# EAGLE design HM-Motorsteuerung (EAGLE 6.6.0)
Assembly variants: Atmega + TH, P, L, Max (RF), Atmega + TH, P, MAX (RF), Atmega + TH, L, MAX (RF), Atmega + TH, MAX (RF), Atmega + TH, P, L, (Wired)
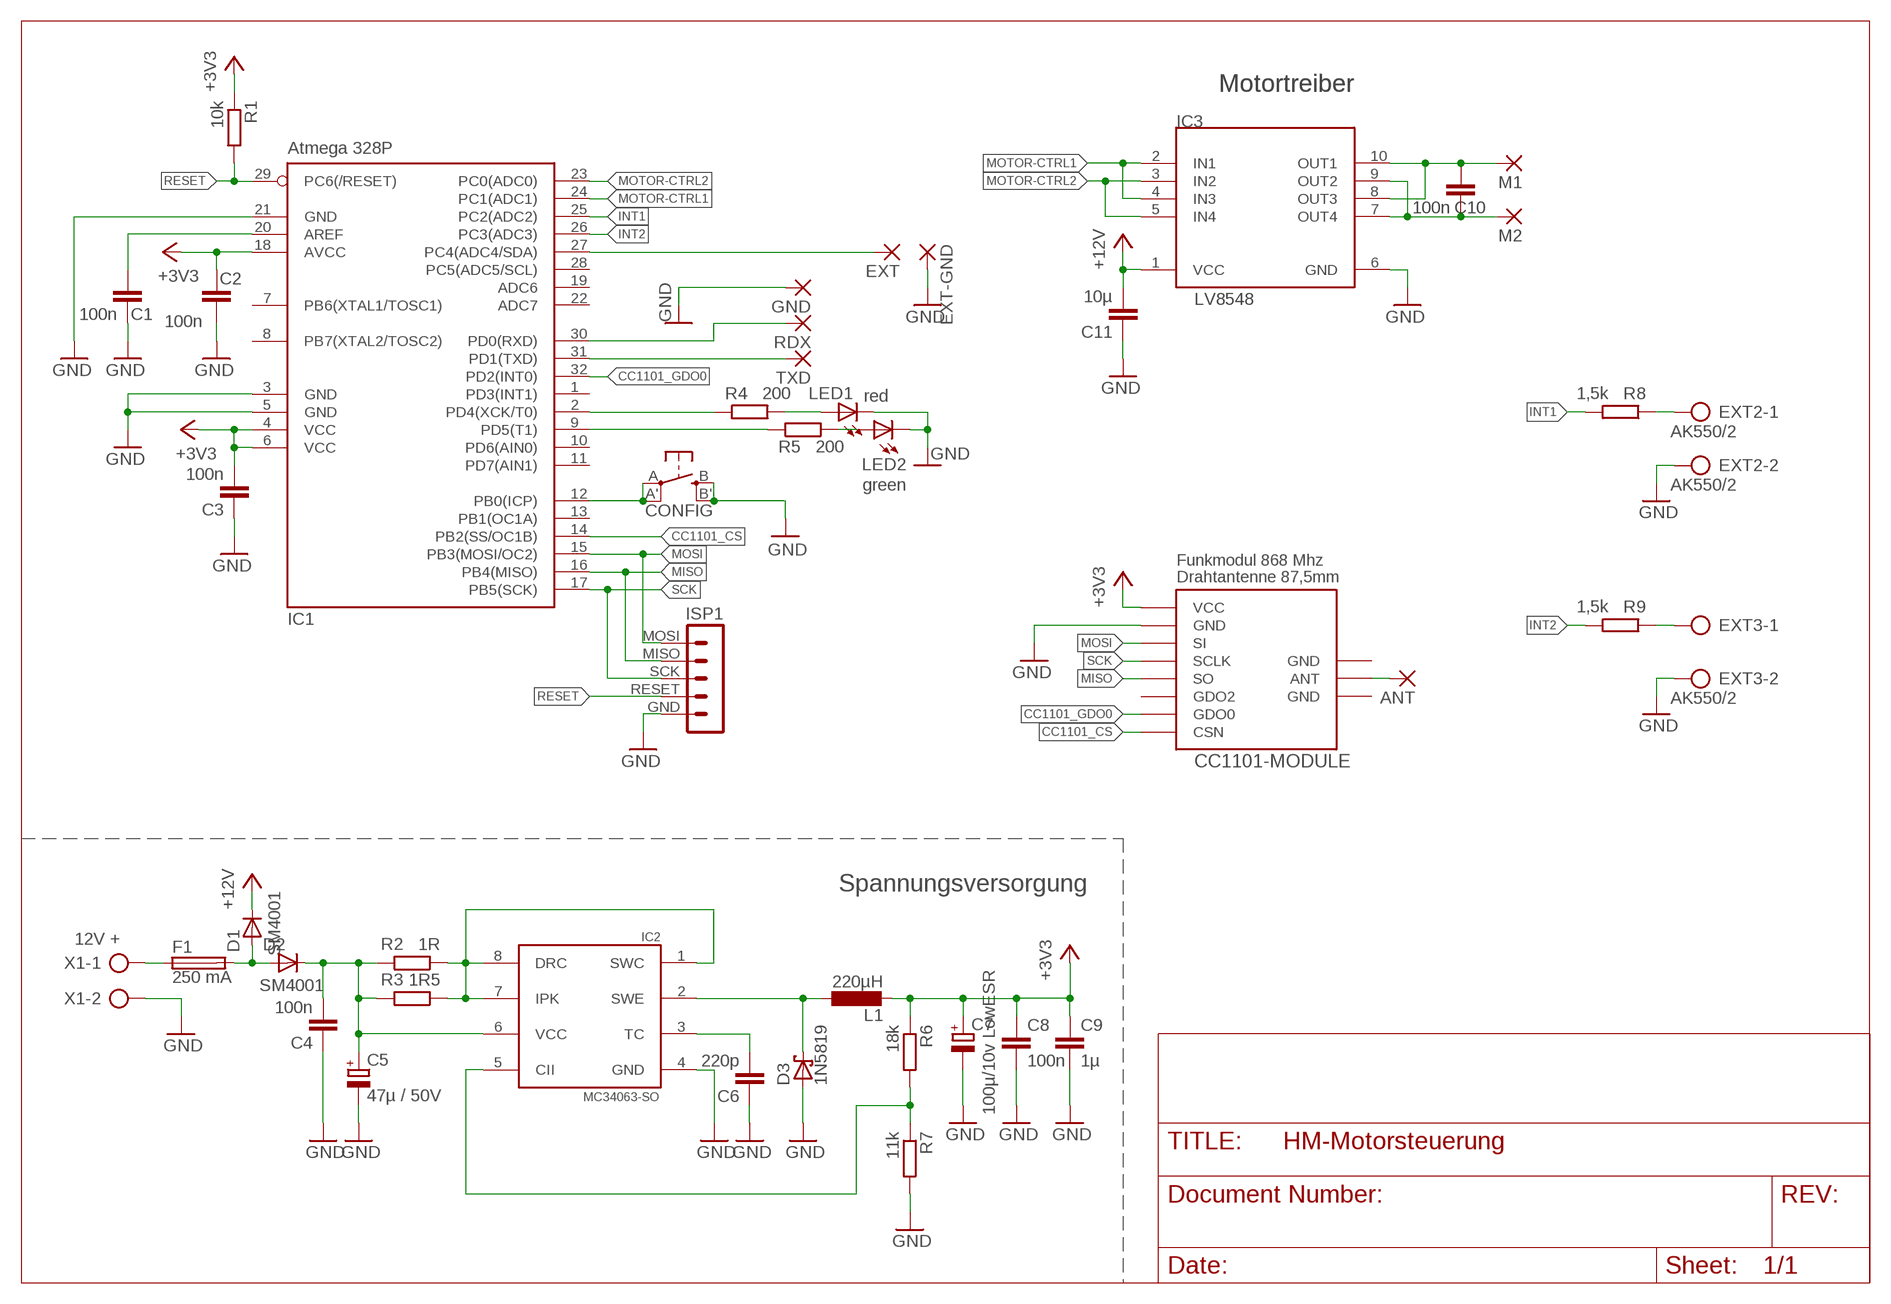
[diagram p0: schematic, sheet 1]

## Parts
ANT  1,6/0,8  [1,6/0,8]  (not fitted in variant Atmega + TH, P, L, (Wired))
C1  100n  C-EUC0805  [C0805]
C2  100n  C-EUC0805  [C0805]
C3  100n  C-EUC0805  [C0805]
C4  100n  C-EUC0805  [C0805]  (not fitted in variant Atmega + TH, P, L, Max (RF))  (not fitted in variant Atmega + TH, P, MAX (RF))  (not fitted in variant Atmega + TH, L, MAX (RF))  (not fitted in variant Atmega + TH, MAX (RF))
C5  47µ / 50V  CPOL-EUE2.5-7  [E2,5-7]  (not fitted in variant Atmega + TH, P, L, Max (RF))  (not fitted in variant Atmega + TH, P, MAX (RF))  (not fitted in variant Atmega + TH, L, MAX (RF))  (not fitted in variant Atmega + TH, MAX (RF))
C6  220p  C-EUC0805  [C0805]  (not fitted in variant Atmega + TH, P, L, Max (RF))  (not fitted in variant Atmega + TH, P, MAX (RF))  (not fitted in variant Atmega + TH, L, MAX (RF))  (not fitted in variant Atmega + TH, MAX (RF))
C7  100µ/10v LowESR  CPOL-EUSMCD  [SMC_D]  (not fitted in variant Atmega + TH, P, L, Max (RF))  (not fitted in variant Atmega + TH, P, MAX (RF))  (not fitted in variant Atmega + TH, L, MAX (RF))  (not fitted in variant Atmega + TH, MAX (RF))
C8  100n  C-EUC0805  [C0805]  (not fitted in variant Atmega + TH, P, L, Max (RF))  (not fitted in variant Atmega + TH, P, MAX (RF))  (not fitted in variant Atmega + TH, L, MAX (RF))  (not fitted in variant Atmega + TH, MAX (RF))
C9  1µ  C-EUC0805  [C0805]  (not fitted in variant Atmega + TH, P, L, Max (RF))  (not fitted in variant Atmega + TH, P, MAX (RF))  (not fitted in variant Atmega + TH, L, MAX (RF))  (not fitted in variant Atmega + TH, MAX (RF))
C10  100n  C-EUC0805  [C0805]
C11  10µ  C-EUC1206  [C1206]
CC1101-MODULE  CC1101_WIRELES_MODULECC1101-SMD  [CC1101]  (not fitted in variant Atmega + TH, P, L, (Wired))
CONFIG  T1  SPST_TACT-EVQQ2  [EVQ-Q2]
D1  SM4001  DIODE-MELF-MLL41  [MELF-MLL41]
D2  SM4001  DIODE-MELF-MLL41  [MELF-MLL41]  (not fitted in variant Atmega + TH, P, L, Max (RF))  (not fitted in variant Atmega + TH, P, MAX (RF))  (not fitted in variant Atmega + TH, L, MAX (RF))  (not fitted in variant Atmega + TH, MAX (RF))
D3  1N5819  SCHOTTKY-DIODESMD  [SMB]  (not fitted in variant Atmega + TH, P, L, Max (RF))  (not fitted in variant Atmega + TH, P, MAX (RF))  (not fitted in variant Atmega + TH, L, MAX (RF))  (not fitted in variant Atmega + TH, MAX (RF))
EXT  WIREPADSMD1,27-254  [SMD1,27-2,54]
EXT2  AK550/2  [AK550/2]
EXT3  AK550/2  [AK550/2]
EXT-GND  WIREPADSMD1,27-254  [SMD1,27-2,54]
F1  250 mA  SMD-MICRO-FUSE  [SMD-6,1X2,6]  (not fitted in variant Atmega + TH, P, L, Max (RF))  (not fitted in variant Atmega + TH, P, MAX (RF))  (not fitted in variant Atmega + TH, L, MAX (RF))  (not fitted in variant Atmega + TH, MAX (RF))
GND  1,6/0,8  [1,6/0,8]
IC1  Atmega 328P  MEGA8-AI  [TQFP32-08]
IC2  MC34063-SO  [SO8]  (not fitted in variant Atmega + TH, P, L, Max (RF))  (not fitted in variant Atmega + TH, P, MAX (RF))  (not fitted in variant Atmega + TH, L, MAX (RF))  (not fitted in variant Atmega + TH, MAX (RF))
IC3  LV8548  [MFP10S]
ISP1  MYISPSMD  [MYISP_SMD]
L1  220µH  L-EUL5650M  [L5650M]  (not fitted in variant Atmega + TH, P, L, Max (RF))  (not fitted in variant Atmega + TH, P, MAX (RF))  (not fitted in variant Atmega + TH, L, MAX (RF))  (not fitted in variant Atmega + TH, MAX (RF))
LED1  red  LEDCHIP-LED0805  [CHIP-LED0805]
LED2  green  LEDCHIP-LED0805  [CHIP-LED0805]
M1  1,6/0,8  [1,6/0,8]
M2  1,6/0,8  [1,6/0,8]
R1  10k  R-EU_M0805  [M0805]
R2  1R  R-EU_R0805  [R0805]  (not fitted in variant Atmega + TH, P, L, Max (RF))  (not fitted in variant Atmega + TH, P, MAX (RF))  (not fitted in variant Atmega + TH, L, MAX (RF))  (not fitted in variant Atmega + TH, MAX (RF))
R3  1R5  R-EU_R0805  [R0805]
R4  200  R-EU_M0805  [M0805]
R5  200  R-EU_M0805  [M0805]
R6  18k  R-EU_R0805  [R0805]  (not fitted in variant Atmega + TH, P, L, Max (RF))  (not fitted in variant Atmega + TH, P, MAX (RF))  (not fitted in variant Atmega + TH, L, MAX (RF))  (not fitted in variant Atmega + TH, MAX (RF))
R7  11k  R-EU_R0805  [R0805]  (not fitted in variant Atmega + TH, P, L, Max (RF))  (not fitted in variant Atmega + TH, P, MAX (RF))  (not fitted in variant Atmega + TH, L, MAX (RF))  (not fitted in variant Atmega + TH, MAX (RF))
R8  1,5k  R-EU_M0805  [M0805]
R9  1,5k  R-EU_M0805  [M0805]
RDX  1,6/0,8  [1,6/0,8]
TXD  1,6/0,8  [1,6/0,8]
X1  AK550/2  [AK550/2]  (not fitted in variant Atmega + TH, P, L, Max (RF))  (not fitted in variant Atmega + TH, P, MAX (RF))  (not fitted in variant Atmega + TH, L, MAX (RF))  (not fitted in variant Atmega + TH, MAX (RF))

## Nets
+3V3: C2.2 C3.2 C7.+ C8.1 C9.1 CC1101-MODULE.VCC IC1.4(VCC) IC1.6(VCC) IC1.18(AVCC) L1.2 R1.1 R6.1
CC1101_CS: CC1101-MODULE.CSN IC1.14(PB2(SS/OC1B))
CC1101_GDO0: CC1101-MODULE.GD00(GDO0) IC1.32(PD2(INT0))
D4: IC1.2(PD4(XCK/T0)) R4.1
D8: CONFIG.A'(P1) CONFIG.A(P) IC1.12(PB0(ICP))
GND: C1.1 C2.1 C3.1 C4.1 C5.- C6.1 C7.- C8.2 C9.2 C11.1 CC1101-MODULE.GND CONFIG.B'(S1) CONFIG.B(S) D3.A EXT2.2 EXT3.2 EXT-GND.1(P) GND.1(P) IC1.3(GND) IC1.5(GND) IC1.21(GND) IC2.4(GND) IC3.6(GND) ISP1.GND LED1.C LED2.C R7.2 X1.2
INT1: IC1.25(PC2(ADC2)) R8.2
INT2: IC1.26(PC3(ADC3)) R9.2
MISO: CC1101-MODULE.SO IC1.16(PB4(MISO)) ISP1.MISO
MOSI: CC1101-MODULE.SI IC1.15(PB3(MOSI/OC2)) ISP1.MOSI
MOTOR-CTRL1: IC1.24(PC1(ADC1)) IC3.2(IN1) IC3.4(IN3)
MOTOR-CTRL2: IC1.23(PC0(ADC0)) IC3.3(IN2) IC3.5(IN4)
N$1: F1.1 X1.1
N$2: EXT2.1 R8.1
N$3: LED2.A R5.2
N$4: LED1.A R4.2
N$5: ANT.1(P) CC1101-MODULE.ANT
N$6: EXT3.1 R9.1
N$7: C10.2 IC3.8(OUT3) IC3.10(OUT1) M1.1(P)
N$8: C10.1 IC3.7(OUT4) IC3.9(OUT2) M2.1(P)
N$9: IC1.9(PD5(T1)) R5.1
N$10: EXT.1(P) IC1.27(PC4(ADC4/SDA))
N$14: C1.2 IC1.20(AREF)
N$16: D1.A D2.A F1.2
N$17: IC2.1(SWC) IC2.7(IPK) IC2.8(DRC) R2.1 R3.1
N$19: C4.2 C5.+ D2.C IC2.6(VCC) R2.2 R3.2
N$20: IC2.5(CII) R6.2 R7.1
N$21: C6.2 IC2.3(TC)
N$22: D3.C IC2.2(SWE) L1.1
RESET: IC1.29(PC6(/RESET)) ISP1.RESET R1.2
RXD: IC1.30(PD0(RXD)) RDX.1(P)
SCK: CC1101-MODULE.SCLK IC1.17(PB5(SCK)) ISP1.SCK
TXD: IC1.31(PD1(TXD)) TXD.1(P)
VCC-MOTOR: C11.2 D1.C IC3.1(VCC) ; supply symbol labelled +12V
Unconnected: CC1101-MODULE.GD02(GDO2) IC1.1(PD3(INT1)) IC1.7(PB6(XTAL1/TOSC1)) IC1.8(PB7(XTAL2/TOSC2)) IC1.10(PD6(AIN0)) IC1.11(PD7(AIN1)) IC1.13(PB1(OC1A)) IC1.19(ADC6) IC1.22(ADC7) IC1.28(PC5(ADC5/SCL))

## Notes on the sheet
- Motortreiber | Motortreiber
- Funkmodul 868 Mhz
- Drahtantenne 87,5mm
- Spannungsversorgung
- 12V +

## Power pins joined to a net without a drawn wire
GND: CC1101-MODULE.GND_0(GND) CC1101-MODULE.GND_1(GND)

## Library data of the parts
ANT GND M1 M2 RDX TXD = wirepad:1,6/0,8: THROUGH-HOLE PAD
C1-C4 C6 C8-C11 = rcl:C-EU: CAPACITOR, European symbol
C5 C7 = rcl:CPOL-EU: POLARIZED CAPACITOR, European symbol
CC1101-MODULE = untitled:CC1101_WIRELES_MODULE
CONFIG = adafruit:SPST_TACT: SMT 6mm switch, EVQQ2 series http://www.ladyada.net/library/eagle
D1 D2 = diode:DIODE-: DIODE
D3 = diode:SCHOTTKY-DIODE: Schottky Diode
EXT EXT-GND = wirepad:WIREPAD: Wire PAD connect wire on PCB
EXT2 EXT3 X1 = con-ptr500:AK550/2: CONNECTOR; OC_FARNELL: unknown; OC_NEWARK: unknown
F1 = f-lf-omniblok-s:SMD-MICRO-FUSE
IC1 = atmel:MEGA8: MICROCONTROLLER 8 Kbytes FLASH, 1 kbytes SRAM, 512 bytes EEPROM, USART, 6-channel 10 bit ADC, 2-channel 8 bit ADC Pin compatible with Atmega48, ATMega88, ATMega168 Source: avr.lbr; MPN: ATMEGA8-16AU; OC_FARNELL: 9171371; OC_NEWARK: 73M8863
IC2 = mc34063:MC34063-SO: DC/DC converter MC34063 in SO08.
IC3 = victor:LV8548; MPN: LV8548MC-AH; OC_NEWARK: 52T8054
ISP1 = untitled:MYISP: PIN HEADER
L1 = rcl:L-EU: INDUCTOR, European symbol
LED1 LED2 = led:LED: LED OSRAM: - CHIPLED LG R971, LG N971, LY N971, LG Q971, LY Q971, LO R971, LY R971 LH N974, LH R974 LS Q976, LO Q976, LY Q976 LO Q996 - Hyper CHIPLED LW Q18S LB Q993, LB Q99A, LB R99A - SideLED LS A670, LO A670, LY A670, LG A670, LP A670 LB A673, LV A673, LT A673, LW A673 LH A674 LY A675 LS A676, LA A676, LO A676, LY A676, LW A676 LS A679, LY A679, LG A679 - Hyper Micro SIDELED® LS Y876, LA Y876, LO Y876, LY Y876 LT Y87S - SmartLED LW L88C, LW L88S LB L89C, LB L89S, LG L890 LS L89K, LO L89K, LY L89K LS L896, LA L896, LO L896, LY L896 - TOPLED LS T670, LO T670, LY T670, LG T670, LP T670 LSG T670, LSP T670, LSY T670, LOP T670, LYG T670 LG T671, LOG T671, LSG T671 LB T673, LV T673, LT T673, LW T673 LH T674 LS T676, LA T676, LO T676, LY T676, LB T676, LH T676, LSB T676, LW T676 LB T67C, LV T67C, LT T67C, LS T67K, LO T67K, LY T67K, LW E67C LS E67B, LA E67B, LO E67B, LY E67B, LB E67C, LV E67C, LT E67C LW T67C LS T679, LY T679, LG T679 LS T770, LO T770, LY T770, LG T770, LP T770 LB T773, LV T773, LT T773, LW T773 LH T774 LS E675, LA E675, LY E675, LS T675 LS T776, LA T776, LO T776, LY T776, LB T776 LHGB T686 LT T68C, LB T68C - Hyper Mini TOPLED® LB M676 - Mini TOPLED Santana® LG M470 LS M47K, LO M47K, LY M47K Source: http://www.osram.convergy.de LUXEON: - LUMILED® LXK2-PW12-R00, LXK2-PW12-S00, LXK2-PW14-U00, LXK2-PW14-V00 LXK2-PM12-R00, LXK2-PM12-S00, LXK2-PM14-U00 LXK2-PE12-Q00, LXK2-PE12-R00, LXK2-PE12-S00, LXK2-PE14-T00, LXK2-PE14-U00 LXK2-PB12-K00, LXK2-PB12-L00, LXK2-PB12-M00, LXK2-PB14-N00, LXK2-PB14-P00, LXK2-PB14-Q00 LXK2-PR12-L00, LXK2-PR12-M00, LXK2-PR14-Q00, LXK2-PR14-R00 LXK2-PD12-Q00, LXK2-PD12-R00, LXK2-PD12-S00 LXK2-PH12-R00, LXK2-PH12-S00 LXK2-PL12-P00, LXK2-PL12-Q00, LXK2-PL12-R00 Source: www.luxeon.com KINGBRIGHT: KA-3528ASYC Source: www.kingbright.com
R1-R9 = rcl:R-EU_: RESISTOR, European symbol

## Net classes
0 default: width 0.203 mm
1 vcc: width 0.254 mm

## Board
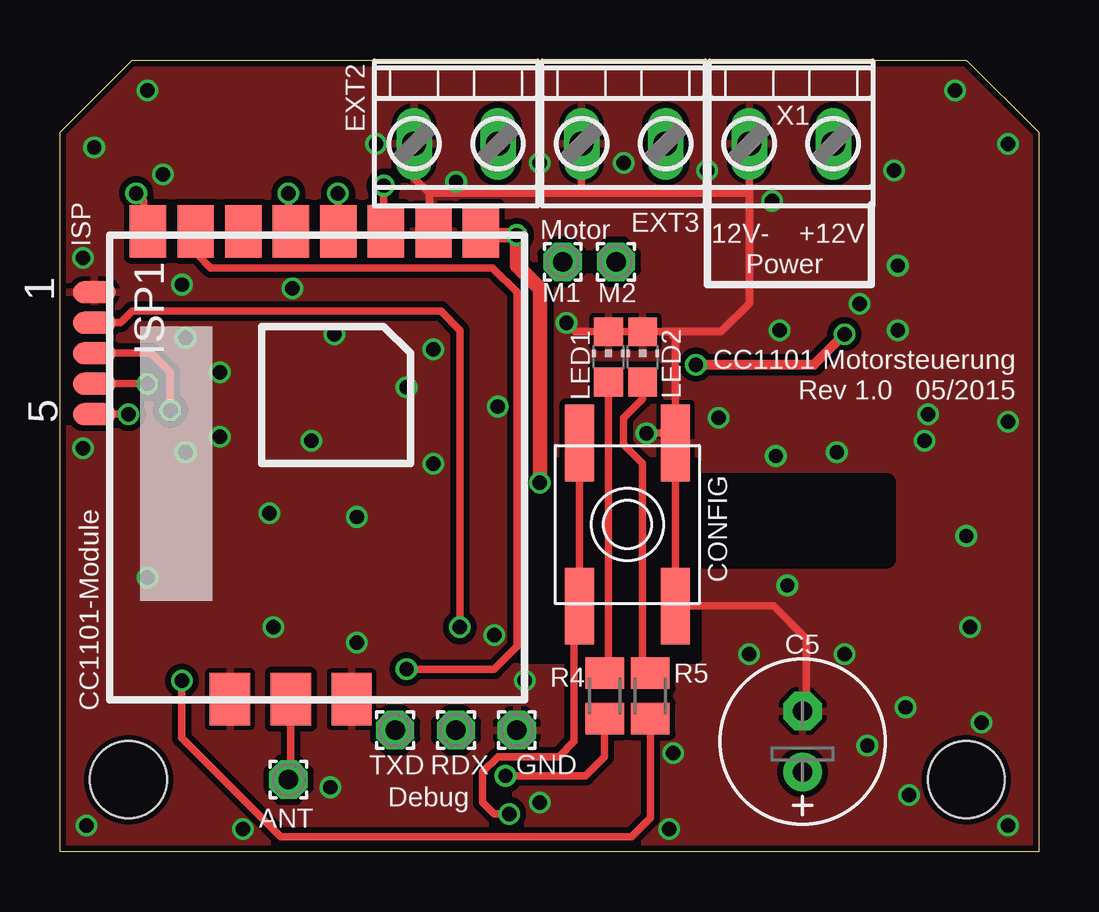
[diagram p1: board, top side]
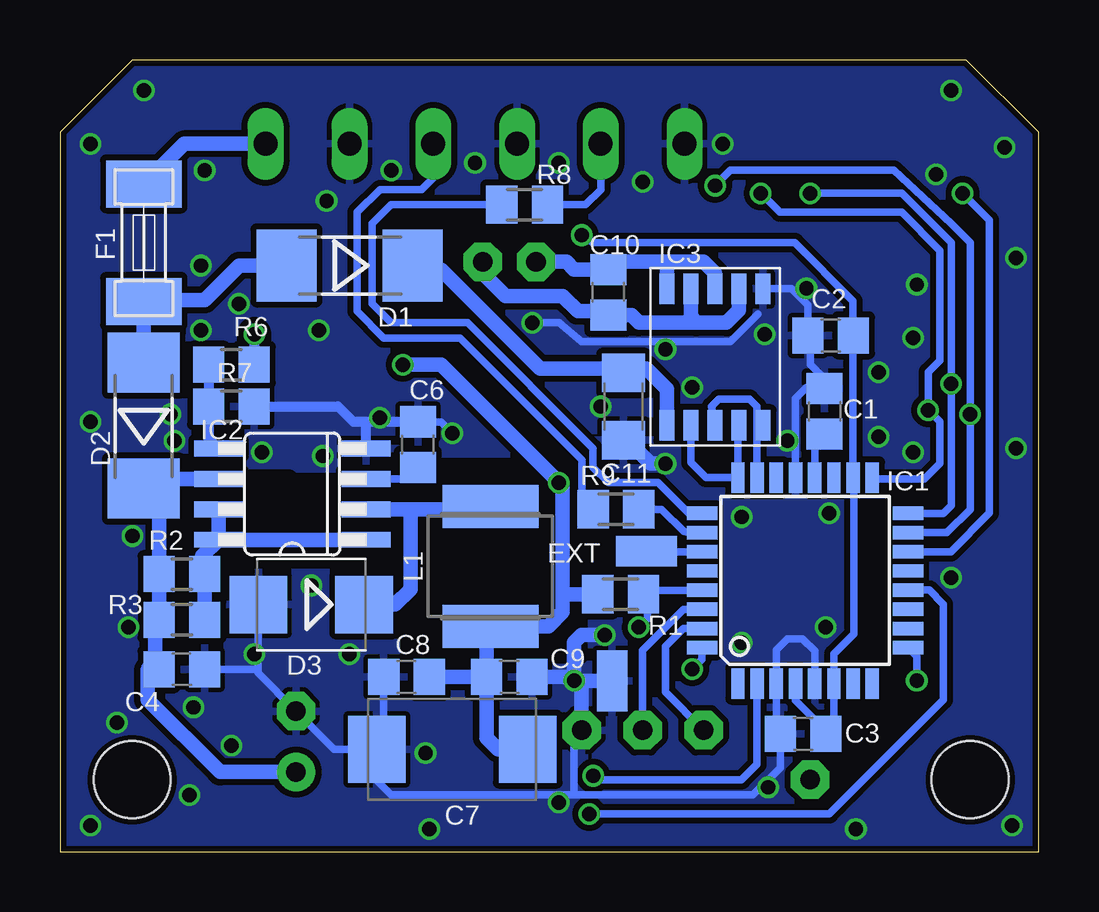
[diagram p2: board, bottom side, seen from below]

Size 40.8 x 33.02 mm. Coordinates in mm from the lower left corner, seen from the top.
Outline: 0,0 0,30 3.02,33.02 37.78,33.02 40.8,30 40.8,0 0,0
Copper layers (1*16): Top 0.018mm / dielectric 1.55mm / Bottom 0.018mm
Design rules "eC_2Layer_PClass6_BaseCopperO18_eCDefault *": minimum track width 0.15mm, minimum drill 0.35mm, track to track 0.15mm, track to pad 0.15mm, pad to pad 0.15mm, via to via 0.15mm, smd to smd 0mil, copper to edge 0.25mm, drill to drill 0.35mm, minimum pad ring 0.175mm, minimum via ring 0.125mm, stop-mask expansion 0mil, vias tented up to drill 0.45mm, thermal gap 0.2mm
Holes 3.2 mm at 2.86,3.02 37.78,3.02
bKeepout: area -0.2,0 to 7.3,6.5; area 33.3,0 to 40.8,6.5
tRestrict: area 19.2,8.1 to 26.5,16.2; area 26.8,12.2 to 34.4,15.4
bRestrict: area 19,8.1 to 26.4,16.2; area 26.8,12.2 to 34.4,15.6

### Footprints (pad centres in the part's own frame; a part is rotated, then mirrored left to right if it is on the bottom)
1,6/0,8 = drill 0.813 pad 1.6 octagon: 1 0,0
C0805 = smd 1.3 x 1.5: 1 -0.95,0; 2 0.95,0
E2,5-7 = drill 0.813 pad 1.6: + -1.27,0 | drill 0.813 pad 1.6 octagon: - 1.27,0
SMC_D = smd 2.4 x 2.8: + -3.15,0; - 3.15,0
C1206 = smd 1.6 x 1.8: 1 -1.4,0; 2 1.4,0
CC1101 = smd 2.184 x 1.676: ANT 19.348,7.556; GND_0 19.348,10.097; GND_1 19.348,5.024 | smd 2.184 x 1.518: CSN -0.159,1.607; GD00 -0.159,3.592; GD02 -0.159,5.576; GND -0.159,13.51; SCLK -0.159,9.541; SI -0.159,11.525; SO -0.159,7.561; VCC -0.159,15.474
EVQ-Q2 = smd 3.2 x 1.2: A -3.4,-2; A' 3.4,-2; B -3.4,2; B' 3.4,2
MELF-MLL41 = smd 2.5 x 3: A 2.625,0; C -2.625,0
SMB = smd 2.4 x 2.4: A 2.2,0; C -2.2,0
SMD1,27-2,54 = smd 1.27 x 2.54: 1 0,0
AK550/2 = drill 1 pad 1.5 long: 1 -1.75,0; 2 1.75,0
SMD-6,1X2,6 = smd 1.96 x 3.15: 1 -2.45,0; 2 2.45,0
TQFP32-08 = smd 1.27 x 0.559: 1 -4.293,2.8; 2 -4.293,2; 3 -4.293,1.2; 4 -4.293,0.4; 5 -4.293,-0.4; 6 -4.293,-1.2; 7 -4.293,-2; 8 -4.293,-2.8; 17 4.293,-2.8; 18 4.293,-2; 19 4.293,-1.2; 20 4.293,-0.4; 21 4.293,0.4; 22 4.293,1.2; 23 4.293,2; 24 4.293,2.8 | smd 0.559 x 1.27: 9 -2.8,-4.293; 10 -2,-4.293; 11 -1.2,-4.293; 12 -0.4,-4.293; 13 0.4,-4.293; 14 1.2,-4.293; 15 2,-4.293; 16 2.8,-4.293; 25 2.8,4.293; 26 2,4.293; 27 1.2,4.293; 28 0.4,4.293; 29 -0.4,4.293; 30 -1.2,4.293; 31 -2,4.293; 32 -2.8,4.293
SO8 = smd 0.66 x 2.032: 1 -1.905,-3.073; 2 -0.635,-3.073; 3 0.635,-3.073; 4 1.905,-3.073; 5 1.905,3.073; 6 0.635,3.073; 7 -0.635,3.073; 8 -1.905,3.073
MFP10S = smd 1.27 x 0.635: 1 -2.85,2; 2 -2.85,1; 3 -2.85,0; 4 -2.85,-1; 5 -2.85,-2; 6 2.85,-2; 7 2.85,-1; 8 2.85,0; 9 2.85,1; 10 2.85,2
MYISP_SMD = smd 0.914 x 1.778: GND -5.08,0; MISO -1.27,0; MOSI 0,0; RESET -3.81,0; SCK -2.54,0
L5650M = smd 1.8 x 4: 1 -2.5,0; 2 2.5,0
CHIP-LED0805 = smd 1.2 x 1.2: A 0,-1.05; C 0,1.05
M0805 = smd 1.3 x 1.6: 1 -0.95,0; 2 0.95,0
R0805 = smd 1.3 x 1.5: 1 -0.95,0; 2 0.95,0

### Placement (x,y rotation side)
ANT  9.53,3.02 0 top
C1  8.93,18.38 270 bottom
C2  8.68,21.53 0 bottom
C3  9.82,4.92 0 bottom
C4  35.72,7.62 180 bottom
C5  30.96,4.6 90 top
C6  25.88,16.99 270 bottom
C7  24.45,4.29 180 bottom
C8  26.35,7.3 180 bottom
C9  22.07,7.3 0 bottom
C10  17.94,23.34 90 bottom
C11  17.3,18.57 90 bottom
CC1101-MODULE  2.06,25.72 270 top
CONFIG  23.65,13.65 270 top
D1  28.73,24.45 180 bottom
D2  37.31,17.78 90 bottom
D3  30.32,10.32 180 bottom
EXT  16.35,12.54 270 bottom
EXT2  16.51,29.53 180 top
EXT3  23.49,29.53 180 top
EXT-GND  17.78,7.14 0 bottom
F1  37.31,25.4 270 bottom
GND  19.05,5.08 0 top
IC1  9.74,11.32 90 bottom
IC2  31.11,14.92 90 bottom
IC3  13.49,20.64 90 bottom
ISP1  1.43,18.26 270 top
L1  22.86,11.91 270 bottom
LED1  22.86,20.64 0 top
LED2  24.29,20.64 0 top
M1  20.95,24.61 90 top
M2  23.18,24.61 90 top
R1  17.43,10.75 0 bottom
R2  35.72,11.59 180 bottom
R3  35.72,9.68 180 bottom
R4  22.7,6.51 90 top
R5  24.61,6.51 90 top
R6  33.66,20.32 180 bottom
R7  33.66,18.57 0 bottom
R8  21.43,26.99 180 bottom
R9  17.62,14.29 0 bottom
RDX  16.51,5.08 0 top
TXD  13.97,5.08 0 top
X1  30.48,29.53 180 top

### Tracks (layer width: path | path; a pad name or v marks a point on that pad's centre or on a via)
+3V3  (via drill 0.6)
  Top 0.305: 17.7,25.72 CC1101-MODULE.VCC
  Top 0.406: v26.51,20.32 31.43,20.32 v32.7,21.59
  Top 0.61: v20,15.4 20,23.5 19.05,24.45 v19.05,25.72 17.7,25.72
  Bottom 0.305: IC1.4 10.14,6.33 9.37,5.56 9.37,5.42 C3.2 8.54,5.26 IC1.6 8.54,8.27 7.71,9.1 7.71,15.58 IC1.18 7.74,21.2 C2.2 7.74,20.91 7.74,22.98 10.16,25.4 18.57,25.4 v19.05,25.72 | C7.+ 22.54,4.29 | 23.02,7.46 C9.1 | 23.02,8.77 L1.2 | 19.8,10.75 19.84,10.64
  Bottom 0.406: v32.7,21.59 R6.1
  Bottom 0.61: 22.54,4.29 23.02,4.76 23.02,7.46 | 23.02,8.77 C9.1 23.97,7.3 24.13,7.3 24.77,7.3 C8.1 | L1.2 20.44,9.41 19.84,10 19.84,10.64 19.84,15.24 v20,15.4 24.92,20.32 v26.51,20.32 | R1.1 19.8,10.75
CC1101_CS  (via drill 0.6)
  Top 0.305: v3.18,27.46 3.49,27.15 3.49,25.56 | 3.49,25.56 3.49,25.1 | CC1101-MODULE.CSN 3.67,25.74 3.49,25.56
  Bottom 0.305: IC1.14 3.67,12.52 2.06,14.13 2.06,26.35 v3.18,27.46
CC1101_GDO0  (via drill 0.6)
  Top 0.305: v14.45,7.62 18.1,7.62 19.05,8.57 19.05,23.34 18.04,24.35 6.29,24.35 5.72,24.92 5.72,25.82 CC1101-MODULE.GD00
  Bottom 0.305: IC1.32 14.03,8.04 v14.45,7.62
D4  (via drill 0.6)
  Top 0.305: v18.57,3.17 21.91,3.17 22.7,3.97 R4.1
  Bottom 0.305: IC1.2 11.74,3.66 12.38,3.02 18.42,3.02 v18.57,3.17
D8  (via drill 0.6)
  Top 0.305: CONFIG.A CONFIG.A' 21.59,11.46 21.59,10.32 21.43,10.16 21.43,4.6 20.8,3.97 18.26,3.97 17.62,3.33 17.62,2.06 18.1,1.59 v18.73,1.59
  Bottom 0.305: IC1.12 4.57,10.92 3.97,10.32 3.97,6.35 8.73,1.59 v18.73,1.59
GND  (via drill 0.6)
  Top 0.305: CONFIG.B CONFIG.B' 29.75,10.25 31.12,8.89 31.12,6.03 C5.- | 28.73,27.46 28.73,22.86 27.56,21.69 25.4,21.69 | 15.57,26.69 CC1101-MODULE.GND 15.4,26.05 15.4,27.46 | 15.4,27.46 21.75,27.46 | 21.75,27.46 28.73,27.46 | EXT3.2 21.75,27.47 21.75,27.46 | EXT2.2 14.76,28.1 15.4,27.46 | X1.2 28.73,27.46 | v21.11,22.07 21.49,21.69 LED1.C LED2.C 25.4,21.69 | CONFIG.B 25.65,21.43 25.4,21.69 | v24.45,17.46 25.24,17.46 CONFIG.B
  Bottom 0.305: C8.2 27.3,4.58 C7.- | C7.- 29.37,4.29 C5.- 32.54,7.46 32.54,7.62 | 19.37,2.38 11.91,2.38 10.77,3.51 C3.1 10.94,5.39 IC1.3 10.94,8.43 10.48,8.89 9.84,8.89 9.34,8.39 IC1.5 | 19.37,2.38 26.99,2.38 27.62,3.02 27.62,4.26 C7.- | 19.37,5.08 19.37,2.38 | IC1.21 10.14,18.91 9.68,19.37 9.12,19.37 C1.1 9.08,19.88 9.53,20.32 9.53,21.11 C2.1 9.63,22.8 10.32,23.5 IC3.6 11.34,23.49 IC3.6 | 11.71,22.42 12.86,21.27 19.05,21.27 20,22.07 v21.11,22.07 | 32.54,7.62 32.54,10.3 D3.A | C4.1 32.54,7.62 | C6.1 24.92,17.94 v24.45,17.46
  Bottom 0.406: R7.2 29.21,18.57 28.58,17.94 28.1,17.94 | 28.1,17.94 C6.1 | IC2.4 28.04,17.88 28.1,17.94
  Bottom 0.61: C11.1 17.17,17.17 16.19,16.19 v15.56,16.19 | v19.37,7.14 19.37,8.73 19.05,9.05 v18.1,9.05 | EXT-GND.1 v19.37,7.14 | GND.1 19.05,6.99 | C9.2 19.53,7.3 v19.37,7.14
  other vias: 6.67,17.3 18.26,18.57 5.24,21.43 5.08,23.65 1.43,29.37 3.65,31.75 37.31,31.75 39.53,29.53 39.53,1.11 1.11,1.11 0.95,16.83 3.65,11.43 16.51,27.94 20,28.73 23.49,28.73 26.99,28.42 29.69,27.15 30,21.75 30.32,11.11 8.73,14.13 14.45,19.37 11.27,2.7 4.29,28.26 13.18,29.53 33.34,22.86 34.93,24.45 37.78,13.18 37.94,9.37 38.42,5.4 35.4,2.38 35.24,6.03 32.7,8.26 20,2.06 28.73,8.26 5.24,16.67 6.67,20 0.95,24.77 34.77,28.42 36.04,17.14 39.53,17.94 8.89,9.37 12.38,8.73 12.38,13.97 10.48,17.14 15.56,20.95 34.93,21.75 33.66,4.45 7.62,0.95 25.4,0.95 25.56,4.13 9.68,23.5 11.43,21.59 29.84,16.51 32.39,16.67 36.2,18.26 27.46,18.1
  pour Bottom (isolate 0.254): 40.96,29.84 40.96,-0.16 -0.16,-0.16 -0.16,29.84 3.02,33.02 37.94,33.02
  pour Top (isolate 0.254): 40.96,29.84 40.96,-0.16 -0.16,-0.16 -0.16,29.84 3.02,33.02 37.94,33.02
INT1
  Bottom 0.305: IC1.25 14.61,14.13 15.88,15.4 17.94,15.4 18.57,16.03 18.57,16.83 23.81,22.07 26.99,22.07 27.78,22.86 27.78,26.19 26.99,26.99 R8.2
INT2
  Bottom 0.305: IC1.26 14.62,13.32 14.78,13.35 15.72,14.29 R9.2
MISO  (via drill 0.6)
  Top 0.305: v9.53,27.46 9.53,25.88 | 9.53,25.88 9.53,25.02 | v3.65,19.53 ISP1.MISO | CC1101-MODULE.SO 9.53,25.88
  Bottom 0.305: IC1.16 3.98,14.12 3.65,14.45 v3.65,19.53 3.65,25.4 5.72,27.46 v9.53,27.46
MOSI  (via drill 0.6)
  Top 0.305: v13.49,27.78 13.49,25.4 | 13.49,25.4 13.49,25.02 | v2.86,18.26 ISP1.MOSI | CC1101-MODULE.SI 13.59,25.5 13.49,25.4
  Bottom 0.305: IC1.15 3.83,13.32 2.86,14.29 v2.86,18.26 2.86,25.4 3.65,26.19 6.03,28.42 12.86,28.42 v13.49,27.78
MOTOR-CTRL1
  Bottom 0.305: IC3.4 12.55,17.73 12.55,16.83 12.54,16.67 IC1.24 13.87,15.61 14.49,16.24 IC3.2
MOTOR-CTRL2
  Bottom 0.305: IC1.23 11.74,17.78 | 11.74,17.78 11.74,18.56 12.07,18.89 13.34,18.89 13.65,18.57 IC3.3 | IC3.5 11.73,17.79 11.74,17.78
N$1
  Bottom 0.61: X1.1 35.63,29.53 F1.1
N$2
  Bottom 0.305: R8.1 18.89,26.99 18.26,27.62 EXT2.1
N$3
  Top 0.305: LED2.A 24.29,18.89 23.5,18.1 23.5,16.99 24.29,16.19 24.29,7.78 R5.2
N$4
  Top 0.305: LED1.A 22.86,7.62 R4.2
N$5
  Top 0.305: CC1101-MODULE.ANT 9.62,3.11 ANT.1
N$6
  Bottom 0.305: R9.1 18.57,13.97 19.05,14.44 19.05,16.35 24.13,21.43 27.31,21.43 28.42,22.54 28.42,26.67 27.46,27.62 25.72,27.62 25.24,28.1 EXT3.1
N$7
  Bottom 0.61: 14.61,24.61 13.97,24.61 13.49,24.13 IC3.8 | 14.61,24.61 17.62,24.61 C10.2 19.37,24.29 19.69,24.61 M1.1 | IC3.10 15.49,24.54 14.61,24.61
N$8
  Bottom 0.305: 17.94,22.54 C10.1
  Bottom 0.61: 14.29,22.07 13.02,22.07 12.49,22.59 IC3.7 | 14.29,22.07 16.67,22.07 16.99,22.38 C10.1 | 14.29,22.07 14.49,22.34 IC3.9 | 17.94,22.54 19.21,22.54 19.84,23.18 22.23,23.18 23.18,24.13 M2.1
N$9  (via drill 0.6)
  Top 0.305: R5.1 24.61,1.43 23.81,0.64 9.21,0.64 5.08,4.76 v5.08,7.14
  Bottom 0.305: v5.08,7.14 5.08,8.15 IC1.9
N$10
  Bottom 0.305: IC1.27 17.12,12.52 EXT.1
N$14
  Bottom 0.305: IC1.20 9.34,17.01 C1.2
N$16
  Bottom 0.305: 37.24,23.02 F1.2
  Bottom 0.61: F1.2 D2.A | D1.A 33.34,24.45 34.77,23.02 37.24,23.02
N$17
  Bottom 0.61: R3.1 R2.1 34.87,12.34 IC2.8 | IC2.8 IC2.7 | IC2.8 IC2.1
N$19
  Bottom 0.305: 37.15,7.59 C4.2 | 36.57,11.33 36.67,11.43 | 36.67,14.52 D2.C 36.9,15.56
  Bottom 0.61: C5.+ 34.13,3.33 37.15,6.35 37.15,7.59 | 36.57,11.33 R2.2 R3.2 36.57,9.63 36.83,9.37 36.83,7.91 C4.2 37.12,7.65 36.67,8.1 | 36.67,11.43 36.67,14.52 | IC2.6 36.9,15.56
N$20
  Bottom 0.406: R6.2 R7.1 34.61,17.24 IC2.5
N$21
  Bottom 0.305: IC2.3 25.88,15.56 C6.2
N$22
  Bottom 0.305: 22.5,14.29 L1.1
  Bottom 0.61: IC2.2 26.19,14.29 | 26.19,14.29 22.5,14.29 | D3.C 26.83,10.32 26.19,10.95 26.19,14.29
RESET  (via drill 0.6)
  Top 0.305: v16.67,9.37 16.67,21.75 15.88,22.54 3.02,22.54 2.54,22.07 ISP1.RESET
  Bottom 0.305: v16.67,9.37 16.31,9.72 16.31,10.92 R1.2 16.35,10.79 16.24,10.91 14.04,10.91 IC1.29
RXD
  Bottom 0.305: IC1.30 14.8,10.12 16.51,8.41 RDX.1
SCK  (via drill 0.6)
  Top 0.305: v11.59,27.46 11.59,25.72 | 11.59,25.72 11.59,24.94 | v4.6,18.41 4.6,20 3.81,20.8 ISP1.SCK | CC1101-MODULE.SCLK 11.6,25.73 11.59,25.72
  Bottom 0.305: IC1.17 6.88,15.56 4.76,15.56 4.13,16.19 4.13,17.94 v4.6,18.41 4.6,20 4.13,20.48 4.13,25.08 5.72,26.67 10.8,26.67 v11.59,27.46
TXD
  Bottom 0.305: IC1.31 14.81,9.32 15.56,8.57 15.56,6.67 TXD.1
VCC-MOTOR
  Bottom 0.305: 26.19,24.36 D1.C
  Bottom 0.61: 17.28,20.16 20.8,20.16 24.92,24.29 26.19,24.36 | IC3.1 15.49,19.3 16.35,20.16 17.28,20.16 | 17.28,20.16 C11.2

### Text on the board
tNames: Motor | ISP | 12V- | +12V | Power | CC1101 Motorsteuerung | Rev 1.0 05/2015 | CC1101-Module | Debug